# Altium schematic sheet PowerSupply.SchDoc: PowerSupply
size A3; Author: Carlos Barreiro; Organization: Escuela Técnica Superior de Ingeniería de Sistemas Informáticos de la Universidad Politécnica de Madrid; Address1: Campus Sur de la Universidad Politécnica de Madrid; Address2: Calle de Alan Turing, s/nº; Address3: Madrid 28031; Address4: España; DocumentNumber: 11; SheetNumber: 11; SheetTotal: 16
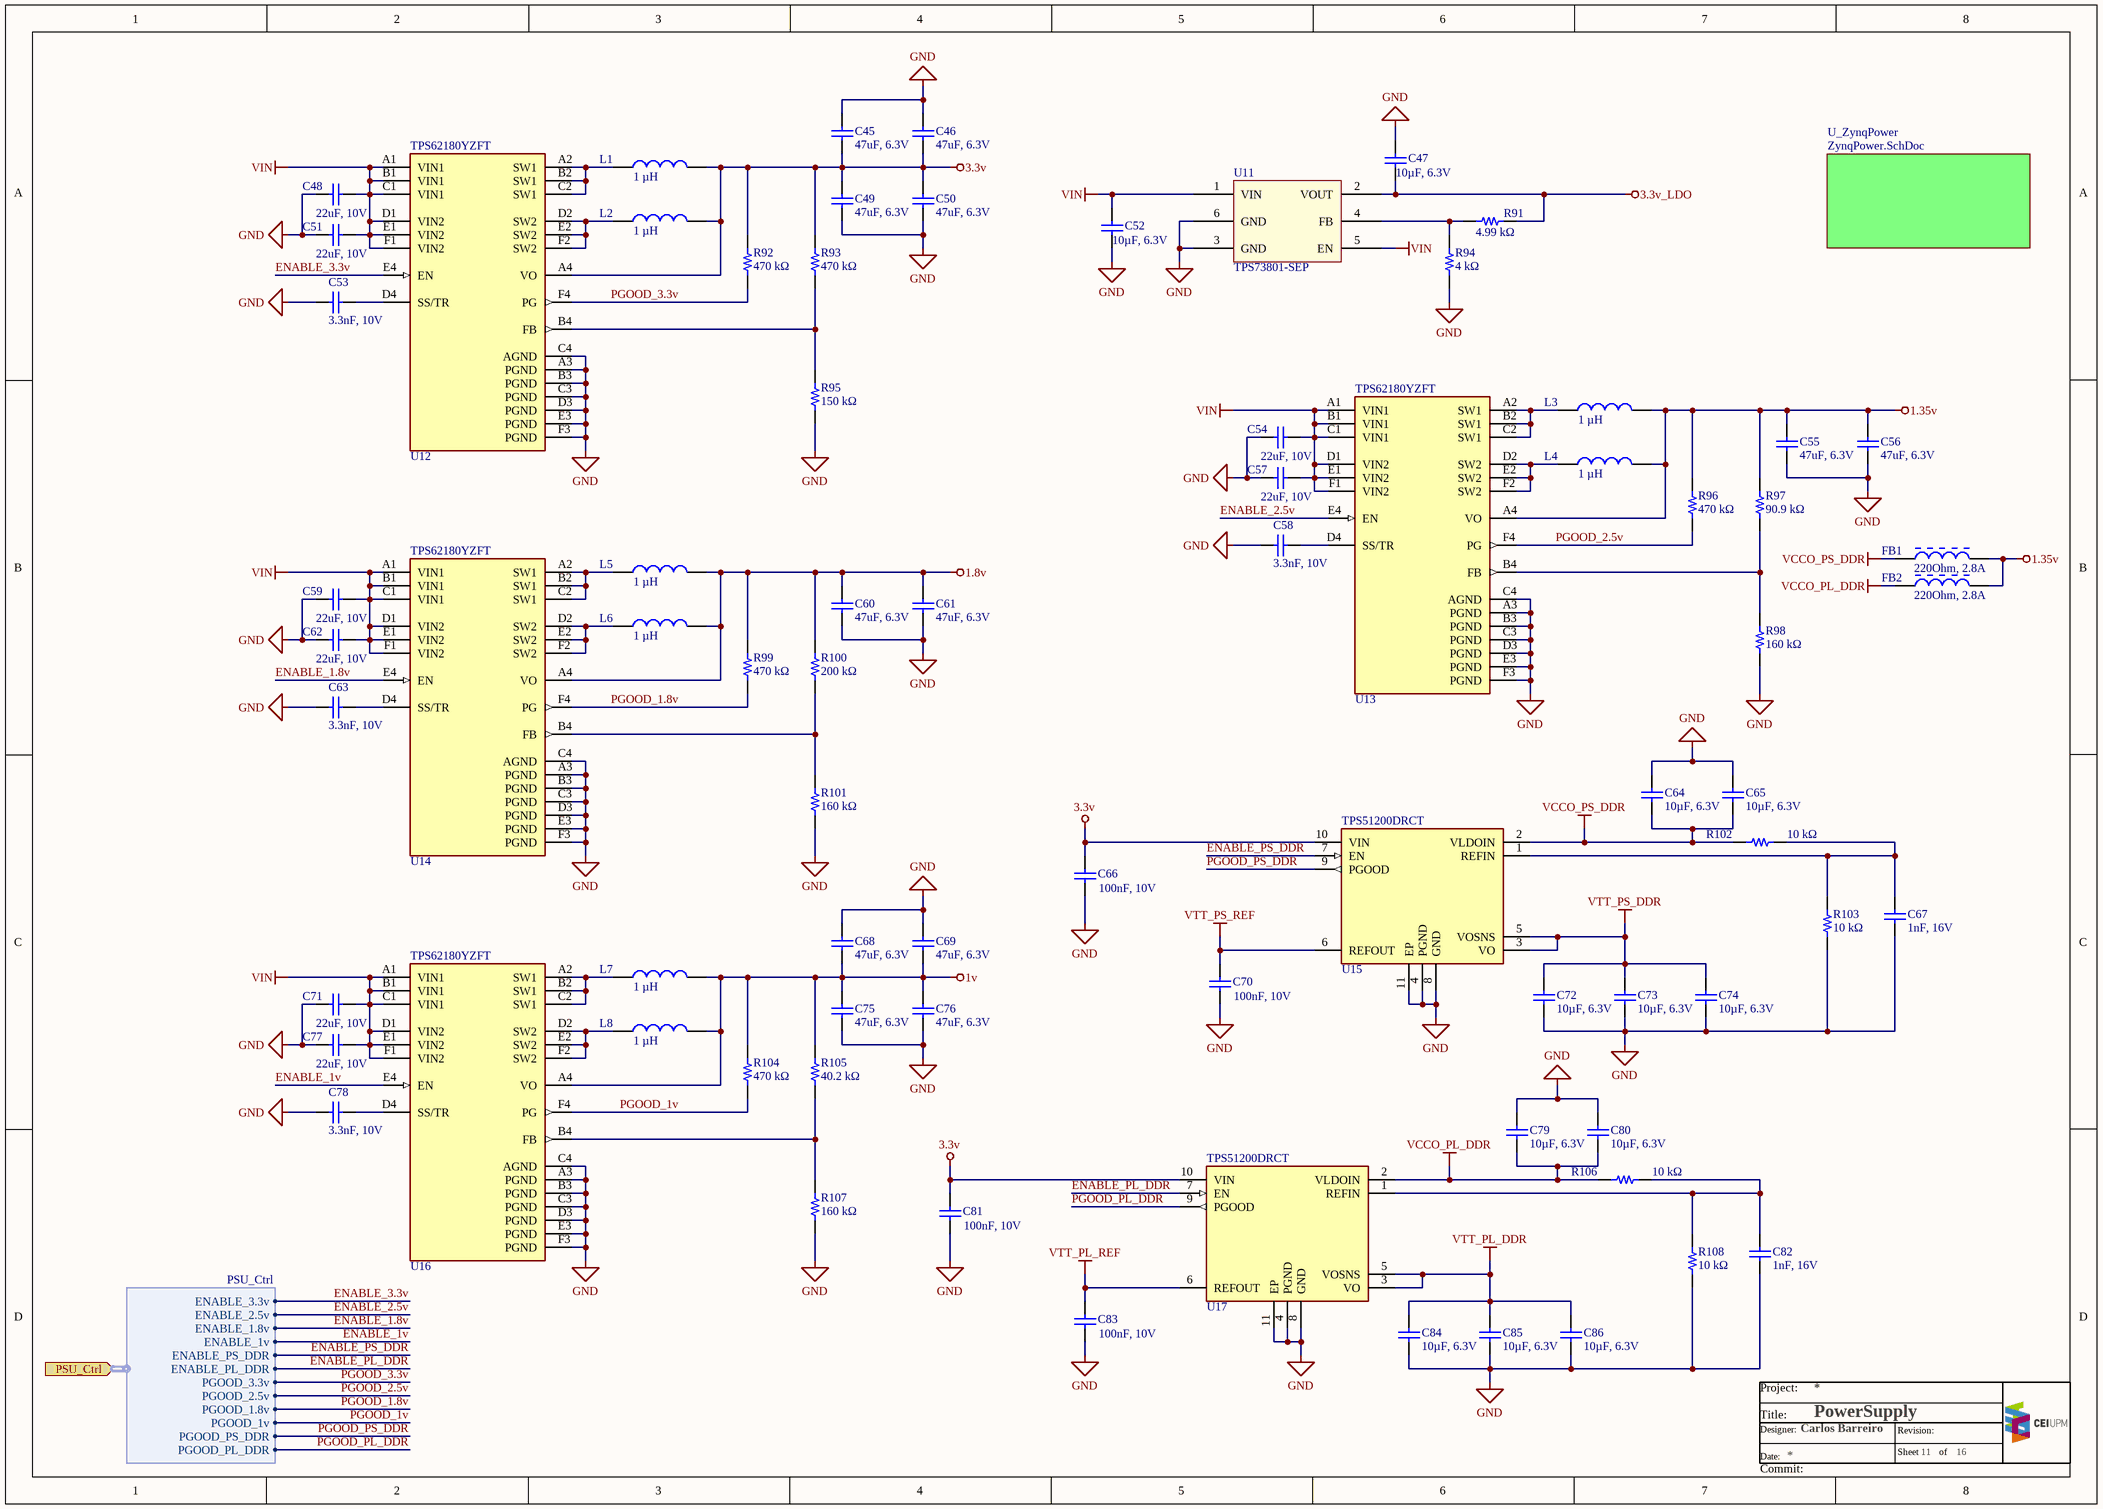
[diagram p0: PowerSupply.SchDoc]

## Parts
C45  47uF, 6.3V  [WURTH_WCAP-CSGP_0805_H=1.25mm]
C46  47uF, 6.3V  [WURTH_WCAP-CSGP_0805_H=1.25mm]
C47  10µF, 6.3V  [WURTH_WCAP-CSGP_0402]
C48  22uF, 10V  [WURTH_WCAP-CSGP_0805_H=1.25mm]
C49  47uF, 6.3V  [WURTH_WCAP-CSGP_0805_H=1.25mm]
C50  47uF, 6.3V  [WURTH_WCAP-CSGP_0805_H=1.25mm]
C51  22uF, 10V  [WURTH_WCAP-CSGP_0805_H=1.25mm]
C52  10µF, 6.3V  [WURTH_WCAP-CSGP_0402]
C53  3.3nF, 10V  [WURTH_WCAP-CSGP_0402]
C54  22uF, 10V  [WURTH_WCAP-CSGP_0805_H=1.25mm]
C55  47uF, 6.3V  [WURTH_WCAP-CSGP_0805_H=1.25mm]
C56  47uF, 6.3V  [WURTH_WCAP-CSGP_0805_H=1.25mm]
C57  22uF, 10V  [WURTH_WCAP-CSGP_0805_H=1.25mm]
C58  3.3nF, 10V  [WURTH_WCAP-CSGP_0402]
C59  22uF, 10V  [WURTH_WCAP-CSGP_0805_H=1.25mm]
C60  47uF, 6.3V  [WURTH_WCAP-CSGP_0805_H=1.25mm]
C61  47uF, 6.3V  [WURTH_WCAP-CSGP_0805_H=1.25mm]
C62  22uF, 10V  [WURTH_WCAP-CSGP_0805_H=1.25mm]
C63  3.3nF, 10V  [WURTH_WCAP-CSGP_0402]
C64  10µF, 6.3V  [WURTH_WCAP-CSGP_0402]
C65  10µF, 6.3V  [WURTH_WCAP-CSGP_0402]
C66  100nF, 10V  [WURTH_WCAP-CSGP_0402]
C67  1nF, 16V  [WURTH_WCAP-CSGP_0402]
C68  47uF, 6.3V  [WURTH_WCAP-CSGP_0805_H=1.25mm]
C69  47uF, 6.3V  [WURTH_WCAP-CSGP_0805_H=1.25mm]
C70  100nF, 10V  [WURTH_WCAP-CSGP_0402]
C71  22uF, 10V  [WURTH_WCAP-CSGP_0805_H=1.25mm]
C72  10µF, 6.3V  [WURTH_WCAP-CSGP_0402]
C73  10µF, 6.3V  [WURTH_WCAP-CSGP_0402]
C74  10µF, 6.3V  [WURTH_WCAP-CSGP_0402]
C75  47uF, 6.3V  [WURTH_WCAP-CSGP_0805_H=1.25mm]
C76  47uF, 6.3V  [WURTH_WCAP-CSGP_0805_H=1.25mm]
C77  22uF, 10V  [WURTH_WCAP-CSGP_0805_H=1.25mm]
C78  3.3nF, 10V  [WURTH_WCAP-CSGP_0402]
C79  10µF, 6.3V  [WURTH_WCAP-CSGP_0402]
C80  10µF, 6.3V  [WURTH_WCAP-CSGP_0402]
C81  100nF, 10V  [WURTH_WCAP-CSGP_0402]
C82  1nF, 16V  [WURTH_WCAP-CSGP_0402]
C83  100nF, 10V  [WURTH_WCAP-CSGP_0402]
C84  10µF, 6.3V  [WURTH_WCAP-CSGP_0402]
C85  10µF, 6.3V  [WURTH_WCAP-CSGP_0402]
C86  10µF, 6.3V  [WURTH_WCAP-CSGP_0402]
FB1  220Ohm, 2.8A  [WURTH-CBF_0805]
FB2  220Ohm, 2.8A  [WURTH-CBF_0805]
L1  1 µH  [Murata_LQH2HPN_JR]
L2  1 µH  [Murata_LQH2HPN_JR]
L3  1 µH  [Murata_LQH2HPN_JR]
L4  1 µH  [Murata_LQH2HPN_JR]
L5  1 µH  [Murata_LQH2HPN_JR]
L6  1 µH  [Murata_LQH2HPN_JR]
L7  1 µH  [Murata_LQH2HPN_JR]
L8  1 µH  [Murata_LQH2HPN_JR]
R91  4.99 kΩ  [PANASONIC_ERJ2G_0402]
R92  470 kΩ  [PANASONIC_ERJ2G_0402]
R93  470 kΩ  [PANASONIC_ERJ2G_0402]
R94  4 kΩ  [PANASONIC_ERJ2G_0402]
R95  150 kΩ  [PANASONIC_ERJ2G_0402]
R96  470 kΩ  [PANASONIC_ERJ2G_0402]
R97  90.9 kΩ  [PANASONIC_ERJ2G_0402]
R98  160 kΩ  [PANASONIC_ERJ2G_0402]
R99  470 kΩ  [PANASONIC_ERJ2G_0402]
R100  200 kΩ  [PANASONIC_ERJ2G_0402]
R101  160 kΩ  [PANASONIC_ERJ2G_0402]
R102  10 kΩ  [PANASONIC_ERJ2G_0402]
R103  10 kΩ  [PANASONIC_ERJ2G_0402]
R104  470 kΩ  [PANASONIC_ERJ2G_0402]
R105  40.2 kΩ  [PANASONIC_ERJ2G_0402]
R106  10 kΩ  [PANASONIC_ERJ2G_0402]
R107  160 kΩ  [PANASONIC_ERJ2G_0402]
R108  10 kΩ  [PANASONIC_ERJ2G_0402]
U11  TPS73801-SEP  [TEXAS_SOT223DCQ]
U12  TPS62180YZFT  [TEXAS_DSBGA24]
U13  TPS62180YZFT  [TEXAS_DSBGA24]
U14  TPS62180YZFT  [TEXAS_DSBGA24]
U15  TPS51200DRCT  [TEXAS_VSON10]
U16  TPS62180YZFT  [TEXAS_DSBGA24]
U17  TPS51200DRCT  [TEXAS_VSON10]

## Sub-sheets
U_ZynqPower = ZynqPower.SchDoc: no entries

## Ports
PSU_Ctrl (in, harness PSU_Ctrl)

## Harnesses
PSU_Ctrl: ENABLE_3.3v, ENABLE_2.5v, ENABLE_1.8v, ENABLE_1v, ENABLE_PS_DDR, ENABLE_PL_DDR, PGOOD_3.3v, PGOOD_2.5v, PGOOD_1.8v, PGOOD_1v, PGOOD_PS_DDR, PGOOD_PL_DDR

## Nets
1.8v: C60.2 C61.2 L5.2 L6.2 R99.2 R100.2 U14.A4(VO)
1.35v: C55.2 C56.2 FB1.2 FB2.2 L3.2 L4.2 R96.2 R97.2 U13.A4(VO)
1v: C68.1 C69.1 C75.2 C76.2 L7.2 L8.2 R104.2 R105.2 U16.A4(VO)
3.3v: C45.1 C46.1 C49.2 C50.2 C66.2 C81.2 L1.2 L2.2 R92.2 R93.2 U12.A4(VO) U15.10(VIN) U17.10(VIN)
3.3v_LDO: C47.1 R91.2 U11.2(VOUT)
GND: C45.2 C46.2 C47.2 C48.2 C49.1 C50.1 C51.2 C52.1 C53.1 C54.2 C55.1 C56.1 C57.2 C58.1 C59.2 C60.1 C61.1 C62.2 C63.1 C64.1 C65.1 C66.1 C67.2 C68.2 C69.2 C70.1 C71.2 C72.1 C73.1 C74.1 C75.1 C76.1 C77.2 C78.1 C79.1 C80.1 C81.1 C82.2 C83.1 C84.1 C85.1 C86.1 R94.2 R95.1 R98.1 R101.1 R103.1 R107.1 R108.1 U11.3(GND) U11.6(GND) U12.A3(PGND) U12.B3(PGND) U12.C3(PGND) U12.C4(AGND) U12.D3(PGND) U12.E3(PGND) U12.F3(PGND) U13.A3(PGND) U13.B3(PGND) U13.C3(PGND) U13.C4(AGND) U13.D3(PGND) U13.E3(PGND) U13.F3(PGND) U14.A3(PGND) U14.B3(PGND) U14.C3(PGND) U14.C4(AGND) U14.D3(PGND) U14.E3(PGND) U14.F3(PGND) U15.4(PGND) U15.8(GND) U15.11(EP) U16.A3(PGND) U16.B3(PGND) U16.C3(PGND) U16.C4(AGND) U16.D3(PGND) U16.E3(PGND) U16.F3(PGND) U17.4(PGND) U17.8(GND) U17.11(EP)
VCCO_PL_DDR: C79.2 C80.2 FB2.1 R106.1 U17.2(VLDOIN)
VCCO_PS_DDR: C64.2 C65.2 FB1.1 R102.1 U15.2(VLDOIN)
VIN: C48.1 C51.1 C52.2 C54.1 C57.1 C59.1 C62.1 C71.1 C77.1 U11.1(VIN) U11.5(EN) U12.A1(VIN1) U12.B1(VIN1) U12.C1(VIN1) U12.D1(VIN2) U12.E1(VIN2) U12.F1(VIN2) U13.A1(VIN1) U13.B1(VIN1) U13.C1(VIN1) U13.D1(VIN2) U13.E1(VIN2) U13.F1(VIN2) U14.A1(VIN1) U14.B1(VIN1) U14.C1(VIN1) U14.D1(VIN2) U14.E1(VIN2) U14.F1(VIN2) U16.A1(VIN1) U16.B1(VIN1) U16.C1(VIN1) U16.D1(VIN2) U16.E1(VIN2) U16.F1(VIN2)
VTT_PL_DDR: C84.2 C85.2 C86.2 U17.3(VO) U17.5(VOSNS)
VTT_PL_REF: C83.2 U17.6(REFOUT)
VTT_PS_DDR: C72.2 C73.2 C74.2 U15.3(VO) U15.5(VOSNS)
VTT_PS_REF: C70.2 U15.6(REFOUT)
ENABLE_1.8v: U14.E4(EN) ; port PSU_Ctrl.ENABLE_1.8v
ENABLE_1v: U16.E4(EN) ; port PSU_Ctrl.ENABLE_1v
ENABLE_2.5v: U13.E4(EN) ; port PSU_Ctrl.ENABLE_2.5v
ENABLE_3.3v: U12.E4(EN) ; port PSU_Ctrl.ENABLE_3.3v
ENABLE_PL_DDR: U17.7(EN) ; port PSU_Ctrl.ENABLE_PL_DDR
ENABLE_PS_DDR: U15.7(EN) ; port PSU_Ctrl.ENABLE_PS_DDR
PGOOD_1.8v: R99.1 U14.F4(PG) ; port PSU_Ctrl.PGOOD_1.8v
PGOOD_1v: R104.1 U16.F4(PG) ; port PSU_Ctrl.PGOOD_1v
PGOOD_2.5v: R96.1 U13.F4(PG) ; port PSU_Ctrl.PGOOD_2.5v
PGOOD_3.3v: R92.1 U12.F4(PG) ; port PSU_Ctrl.PGOOD_3.3v
PGOOD_PL_DDR: U17.9(PGOOD) ; port PSU_Ctrl.PGOOD_PL_DDR
PGOOD_PS_DDR: U15.9(PGOOD) ; port PSU_Ctrl.PGOOD_PS_DDR
NetC53_2: C53.2 U12.D4(SS/TR)
NetC58_2: C58.2 U13.D4(SS/TR)
NetC63_2: C63.2 U14.D4(SS/TR)
NetC67_1: C67.1 R102.2 R103.2 U15.1(REFIN)
NetC78_2: C78.2 U16.D4(SS/TR)
NetC82_1: C82.1 R106.2 R108.2 U17.1(REFIN)
NetL1_1: L1.1 U12.A2(SW1) U12.B2(SW1) U12.C2(SW1)
NetL2_1: L2.1 U12.D2(SW2) U12.E2(SW2) U12.F2(SW2)
NetL3_1: L3.1 U13.A2(SW1) U13.B2(SW1) U13.C2(SW1)
NetL4_1: L4.1 U13.D2(SW2) U13.E2(SW2) U13.F2(SW2)
NetL5_1: L5.1 U14.A2(SW1) U14.B2(SW1) U14.C2(SW1)
NetL6_1: L6.1 U14.D2(SW2) U14.E2(SW2) U14.F2(SW2)
NetL7_1: L7.1 U16.A2(SW1) U16.B2(SW1) U16.C2(SW1)
NetL8_1: L8.1 U16.D2(SW2) U16.E2(SW2) U16.F2(SW2)
NetR91_1: R91.1 R94.1 U11.4(FB)
NetR93_1: R93.1 R95.2 U12.B4(FB)
NetR97_1: R97.1 R98.2 U13.B4(FB)
NetR100_1: R100.1 R101.2 U14.B4(FB)
NetR105_1: R105.1 R107.2 U16.B4(FB)

## Notes on the sheet
- Project:
- Title:
- Date:
- Designer:
- Sheet
- Revision:
- of
- Commit:

## Library data of the parts
C45 C46 C49 C50 C55 C56 C60 C61 C68 C69 C75 C76 = 885012107006: WCAP-CSGP Multilayer Ceramic Chip Capacitor, General Purpose, size 0805, X5R, 47uF, 6.3V; Manufacturer: Wurth Elektronik; Rated Voltage: 6.3VDC; Isolation Resistance  min.: 0.002GOhm; Capacitance Tolerance: +/-20%; Dissipation Factor max.: 10%; Technical Reference: X5R0805476M6R3DFCT10000; ComponentLink1Description: Manufacturer; ComponentLink1URL: http://www.we-online.de; ComponentLink2Description: Datasheet; ComponentLink2URL: https://www.we-online.com/catalog/datasheet/885012107006.pdf; Operating Temperature: -55 to +85degC; Packaging: Tape and Reel; Manufacturer Part Number: 885012107006; Published Date: April 2021; Ceramic Type: X5R; Height: 1.25mm; Mounting Technology: SMT; Size: 0805; Capacitance: 47uF; Q-Factor min.: -
C47 C52 C64 C65 C72-C74 C79 C80 C84-C86 = 885012105020: WCAP-CSGP Multilayer Ceramic Chip Capacitor, General Purpose, size 0402, X5R, 10uF, 6.3V; Manufacturer: Wurth Elektronik; Rated Voltage: 6.3VDC; Isolation Resistance  min.: 0.01GOhm; Capacitance Tolerance: +/20%; Dissipation Factor max.: 10%; Technical Reference: X5R0402106M6R3DFCT10000; ComponentLink1Description: Manufacturer; ComponentLink1URL: http://www.we-online.de; ComponentLink2Description: Datasheet; ComponentLink2URL: https://www.we-online.com/catalog/datasheet/885012105020.pdf; Operating Temperature: -55 to +85degC; Packaging: Tape and Reel; Manufacturer Part Number: 885012105020; Published Date: April 2021; Ceramic Type: X5R; Height: 0.5mm; Mounting Technology: SMT; Size: 0402; Capacitance: 10uF; Q-Factor min.: -
C48 C51 C54 C57 C59 C62 C71 C77 = 885012107011: WCAP-CSGP Multilayer Ceramic Chip Capacitor, General Purpose, size 0805, X5R, 22uF, 10V; Manufacturer: Wurth Elektronik; Rated Voltage: 10VDC; Isolation Resistance  min.: 0.005GOhm; Capacitance Tolerance: +/-20%; Dissipation Factor max.: 10%; Technical Reference: X5R0805226M010DFCT10000; ComponentLink1Description: Manufacturer; ComponentLink1URL: http://www.we-online.de; ComponentLink2Description: Datasheet; ComponentLink2URL: https://www.we-online.com/catalog/datasheet/885012107011.pdf; Operating Temperature: -55 to +85degC; Packaging: Tape and Reel; Manufacturer Part Number: 885012107011; Published Date: April 2021; Ceramic Type: X5R; Height: 1.25mm; Mounting Technology: SMT; Size: 0805; Capacitance: 22uF; Q-Factor min.: -
C53 C58 C63 C78 = 885012205009: WCAP-CSGP Multilayer Ceramic Chip Capacitor, General Purpose, size 0402, X7R, 3.3nF, 10V; Manufacturer: Wurth Elektronik; Rated Voltage: 10VDC; Isolation Resistance  min.: 10GOhm; Capacitance Tolerance: +/-10%; Dissipation Factor max.: 5%; Technical Reference: X7R0402332K010DFCT10000; ComponentLink1Description: Manufacturer; ComponentLink1URL: http://www.we-online.de; ComponentLink2Description: Datasheet; ComponentLink2URL: https://www.we-online.com/catalog/datasheet/885012205009.pdf; Operating Temperature: -55 to +125degC; Packaging: Tape and Reel; Manufacturer Part Number: 885012205009; Published Date: April 2021; Ceramic Type: X7R; Height: 0.5mm; Mounting Technology: SMT; Size: 0402; Capacitance: 3.3nF; Q-Factor min.: -
C66 C70 C81 C83 = 885012205018: WCAP-CSGP Multilayer Ceramic Chip Capacitor, General Purpose, size 0402, X7R, 100nF, 10V; Manufacturer: Wurth Elektronik; Rated Voltage: 10VDC; Isolation Resistance  min.: 5GOhm; Capacitance Tolerance: +/-10%; Dissipation Factor max.: 5%; Technical Reference: X7R0402104K010DFCT10000; ComponentLink1Description: Manufacturer; ComponentLink1URL: http://www.we-online.de; ComponentLink2Description: Datasheet; ComponentLink2URL: https://www.we-online.com/catalog/datasheet/885012205018.pdf; Operating Temperature: -55 to +125degC; Packaging: Tape and Reel; Manufacturer Part Number: 885012205018; Published Date: April 2021; Ceramic Type: X7R; Height: 0.5mm; Mounting Technology: SMT; Size: 0402; Capacitance: 100nF; Q-Factor min.: -
C67 C82 = 885012205025: WCAP-CSGP Multilayer Ceramic Chip Capacitor, General Purpose, size 0402, X7R, 1nF, 16V; Manufacturer: Wurth Elektronik; Rated Voltage: 16VDC; Isolation Resistance  min.: 10GOhm; Capacitance Tolerance: +/-10%; Dissipation Factor max.: 3.5%; Technical Reference: X7R0402102K016DFCT10000; ComponentLink1Description: Manufacturer; ComponentLink1URL: http://www.we-online.de; ComponentLink2Description: Datasheet; ComponentLink2URL: https://www.we-online.com/catalog/datasheet/885012205025.pdf; Operating Temperature: -55 to +125degC; Packaging: Tape and Reel; Manufacturer Part Number: 885012205025; Published Date: April 2021; Ceramic Type: X7R; Height: 0.5mm; Mounting Technology: SMT; Size: 0402; Capacitance: 1nF; Q-Factor min.: -
FB1 FB2 = 742792034: WE-CBF SMT EMI Suppression Ferrite Bead, size 0805, 220Ohm, 2.8A; Manufacturer: Wurth Elektronik; Impedance max.: 300Ohm; DC Resistance max.: 0.3Ohm; Type: High Speed; ComponentLink1Description: Manufacturer; ComponentLink1URL: http://www.we-online.de; ComponentLink2Description: Datasheet; ComponentLink2URL: https://www.we-online.com/catalog/datasheet/742792034.pdf; Operating Temperature: -55 to +125degC; Packaging: Tape and Reel; Published Date: December 2021; Rated Current: 2.8A; Manufacturer Part Number: 742792034; Impedance @100MHz: 220Ohm; Mounting Technology: SMT; Size: 0805; Height: 0.9mm; Length: 2mm; Width: 1.2mm
L1-L8 = LQH2HPN1R0NJR: Wire Wound Ferrite Inductor; Manufacturer: Murata; Inductance: 470 nH - 22 µH; AEC 200: Grade 0; Length (mm): 2.5; Width (mm): 2; ComponentLink1Description: Manufacturer; ComponentLink1URL: https://www.murata.com/search/productsearch?cate=cgInductors&partno=LQH2HPN_JR&realtime=1&sort=d_inductance; Height (mm): 1.2; Operating temperature range (C): −40°C to +125°C; Series: LQH2HPN_JR; Supplier 1: Digi-Key; Supplier 2: Mouser; Supplier Part Number 1: 490-9898-1-ND; Supplier Part Number 2: 81-LQH2HPN1R0NJRL
R91 = ERJ2RKF4991X: General Purpose Thick Film Chip Resistors; Manufacturer: Panasonic; Power (0402): 0.1 W; Limiting Voltage (0402): 50; Maximum Voltage (0402): 100; Resistance Range (Ω): 1Ω to 100MΩ; AEC 200: Grade 0; Size (0402): 2GE; ComponentLink1Description: Catalog; ComponentLink1URL: https://industrial.panasonic.com/ww/products/pt/general-purpose-chip-resistors/models?op=search&model_status_current=1&page=0#model-list-search-results; Series: ERJ; Temperature Range (ºC): -55 to +155; Supplier 1: Digi-Key; Supplier Part Number 1: P4.99KLTR-ND
R92 R93 R96 R99 R104 = ERJ2RKF4703X: General Purpose Thick Film Chip Resistors; Manufacturer: Panasonic; Power (0402): 0.1 W; Limiting Voltage (0402): 50; Maximum Voltage (0402): 100; Resistance Range (Ω): 1Ω to 100MΩ; AEC 200: Grade 0; Size (0402): 2GE; ComponentLink1Description: Catalog; ComponentLink1URL: https://industrial.panasonic.com/ww/products/pt/general-purpose-chip-resistors/models?op=search&model_status_current=1&page=0#model-list-search-results; Series: ERJ; Temperature Range (ºC): -55 to +155; Supplier 1: Digi-Key; Supplier Part Number 1: P470KLCT-ND
R94 = ERJ2RKF4021X: General Purpose Thick Film Chip Resistors; Manufacturer: Panasonic; Power (0402): 0.1 W; Limiting Voltage (0402): 50; Maximum Voltage (0402): 100; Resistance Range (Ω): 1Ω to 100MΩ; AEC 200: Grade 0; Size (0402): 2GE; ComponentLink1Description: Catalog; ComponentLink1URL: https://industrial.panasonic.com/ww/products/pt/general-purpose-chip-resistors/models?op=search&model_status_current=1&page=0#model-list-search-results; Series: ERJ; Temperature Range (ºC): -55 to +155; Supplier 1: Digi-Key; Supplier 2: Digi-Key; Supplier Part Number 2: P4.02KLDKR-ND; Supplier Part Number 1: P4.02KLCT-ND
R95 = ERJ2RKF1503X: General Purpose Thick Film Chip Resistors; Manufacturer: Panasonic; Power (0402): 0.1 W; Limiting Voltage (0402): 50; Maximum Voltage (0402): 100; Resistance Range (Ω): 1Ω to 100MΩ; AEC 200: Grade 0; Size (0402): 2GE; ComponentLink1Description: Catalog; ComponentLink1URL: https://industrial.panasonic.com/ww/products/pt/general-purpose-chip-resistors/models?op=search&model_status_current=1&page=0#model-list-search-results; Series: ERJ; Temperature Range (ºC): -55 to +155; Supplier 1: Digi-Key; Supplier Part Number 1: P150KLCT-ND
R97 = ERJ2RKF9092X: General Purpose Thick Film Chip Resistors; Manufacturer: Panasonic; Power (0402): 0.1 W; Limiting Voltage (0402): 50; Maximum Voltage (0402): 100; Resistance Range (Ω): 1Ω to 100MΩ; AEC 200: Grade 0; Size (0402): 2GE; ComponentLink1Description: Catalog; ComponentLink1URL: https://industrial.panasonic.com/ww/products/pt/general-purpose-chip-resistors/models?op=search&model_status_current=1&page=0#model-list-search-results; Series: ERJ; Temperature Range (ºC): -55 to +155; Supplier 1: Mouser; Supplier Part Number 1: 667-ERJ-2RKF9092X; Supplier 2: Digi-Key; Supplier Part Number 2: P90.9KLCT-ND
R98 R101 R107 = ERJ2RKF1603X: General Purpose Thick Film Chip Resistors; Manufacturer: Panasonic; Power (0402): 0.1 W; Limiting Voltage (0402): 50; Maximum Voltage (0402): 100; Resistance Range (Ω): 1Ω to 100MΩ; AEC 200: Grade 0; Size (0402): 2GE; ComponentLink1Description: Catalog; ComponentLink1URL: https://industrial.panasonic.com/ww/products/pt/general-purpose-chip-resistors/models?op=search&model_status_current=1&page=0#model-list-search-results; Series: ERJ; Temperature Range (ºC): -55 to +155; Supplier 1: Digi-Key; Supplier Part Number 1: P160KLCT-ND
R100 = ERJ2RKF2003X: General Purpose Thick Film Chip Resistors; Manufacturer: Panasonic; Power (0402): 0.1 W; Limiting Voltage (0402): 50; Maximum Voltage (0402): 100; Resistance Range (Ω): 1Ω to 100MΩ; AEC 200: Grade 0; Size (0402): 2GE; ComponentLink1Description: Catalog; ComponentLink1URL: https://industrial.panasonic.com/ww/products/pt/general-purpose-chip-resistors/models?op=search&model_status_current=1&page=0#model-list-search-results; Series: ERJ; Temperature Range (ºC): -55 to +155; Supplier 1: Digi-Key; Supplier Part Number 1: P200KLCT-ND
R102 R103 R106 R108 = ERJ2RKF1002X: General Purpose Thick Film Chip Resistors; Manufacturer: Panasonic; Power (0402): 0.1 W; Limiting Voltage (0402): 50; Maximum Voltage (0402): 100; Resistance Range (Ω): 1Ω to 100MΩ; AEC 200: Grade 0; Size (0402): 2GE; ComponentLink1Description: Catalog; ComponentLink1URL: https://industrial.panasonic.com/ww/products/pt/general-purpose-chip-resistors/models?op=search&model_status_current=1&page=0#model-list-search-results; Series: ERJ; Temperature Range (ºC): -55 to +155; Supplier 1: Digi-Key; Supplier 2: Mouser; Supplier Part Number 1: P10.0KLCT-ND; Supplier Part Number 2: 667-ERJ-2RKF1002X
R105 = ERJ2RKF4022X: General Purpose Thick Film Chip Resistors; Manufacturer: Panasonic; Power (0402): 0.1 W; Limiting Voltage (0402): 50; Maximum Voltage (0402): 100; Resistance Range (Ω): 1Ω to 100MΩ; AEC 200: Grade 0; Size (0402): 2GE; ComponentLink1Description: Catalog; ComponentLink1URL: https://industrial.panasonic.com/ww/products/pt/general-purpose-chip-resistors/models?op=search&model_status_current=1&page=0#model-list-search-results; Series: ERJ; Temperature Range (ºC): -55 to +155; Supplier 1: Digi-Key; Supplier Part Number 1: P40.2KLTR-ND
U11 = TPS73801-SEP: Radiation-hardened, 2.2-V to 20-V, 1-A low-noise adjustable output LDO in Space Enhanced Plastic; Iout (Max) (A): 1; Vin (Max) (V): 20; Vin (Min) (V): 2.2; Vout (Min) (V): 1.21; ComponentLink1Description: Manufacturer; ComponentLink1URL: https://www.ti.com/product/TPS73801-SEP#pps; ComponentLink2Description: Datasheet; ComponentLink2URL: https://www.ti.com/lit/ds/symlink/tps73801-sep.pdf?ts=1639038776346&ref_url=https%253A%252F%252Fwww.ti.com%252Fproduct%252FTPS73801-SEP; Vout (Max) (V): 20; Iq (Typ) (mA): 1; Operating temperature range (C): -55 to 125; Radiation, TID (Typ) (krad): 50; Radiation, SEL (MeV.cm2/mg): 43; Rating: Space
U12-U14 U16 = TPS62180YZFT: TPS6218x 4-V to 15-V, 6-A, 2-Phase Step-Down Converters; Body Size (mm): 2.10 mm x 3.10 mm; Vin (Min) (V): 4; Vin (Max) (V): 15; Vout (Min) (V): 0.9; Vout (Max) (V): 6; Iq (Typ) (uA): 30; Switching frequency (Min) (kHz): 1000; Switching frequency (Max) (kHz): 2000; Rating: Catalog; Regulated outputs (#): 1; Package: DSBGA 24; Iout (Max) (A): 6; Operating temperature range (C): -40ºC to 125ºC; ComponentLink1Description: Manufacturer; ComponentLink1URL: https://www.ti.com/product/TPS62184; Supplier 1: Digi-Key; Supplier 2: Mouser; Supplier Part Number 1: 296-38369-6-ND; Supplier Part Number 2: 595-TPS62180YZFT
U15 U17 = TPS51200DRCT: 3A Sink/Source DDR Termination Regulator w/ VTTREF Buffered Reference for DDR2, DDR3, DDR3L and DDR4 10-VSON -40 to 85; MF: Texas Instruments; DDR memory type: DDR, DDR2, DDR3, DDR3L, LPDDR2, LPDDR3; Control mode: D-CAP, S4/S5; Iout VDDQ (Max) (A): 20; Iq (Typ) (mA): 0.6; Output: VDDQ, VREF, VTT; Vin (Min) (V): 3; Vin (Max) (V): 28; Rating: HiRel Enhanced Product; MP: TPS51200DRCT; Package: VSON-10; Supplier 1: Digi-Key; Supplier 2: Mouser; Supplier Part Number 1: 296-23830-1-ND; Supplier Part Number 2: 595-TPS51200DRCT; Iout VTT (Max) (A): *; Operating temperature range (C): -55ºC to 125ºC